# Altium schematic sheet DAC.SchDoc: Digital to Analog Converter
size A4; SheetNumber: 2; SheetTotal: 4
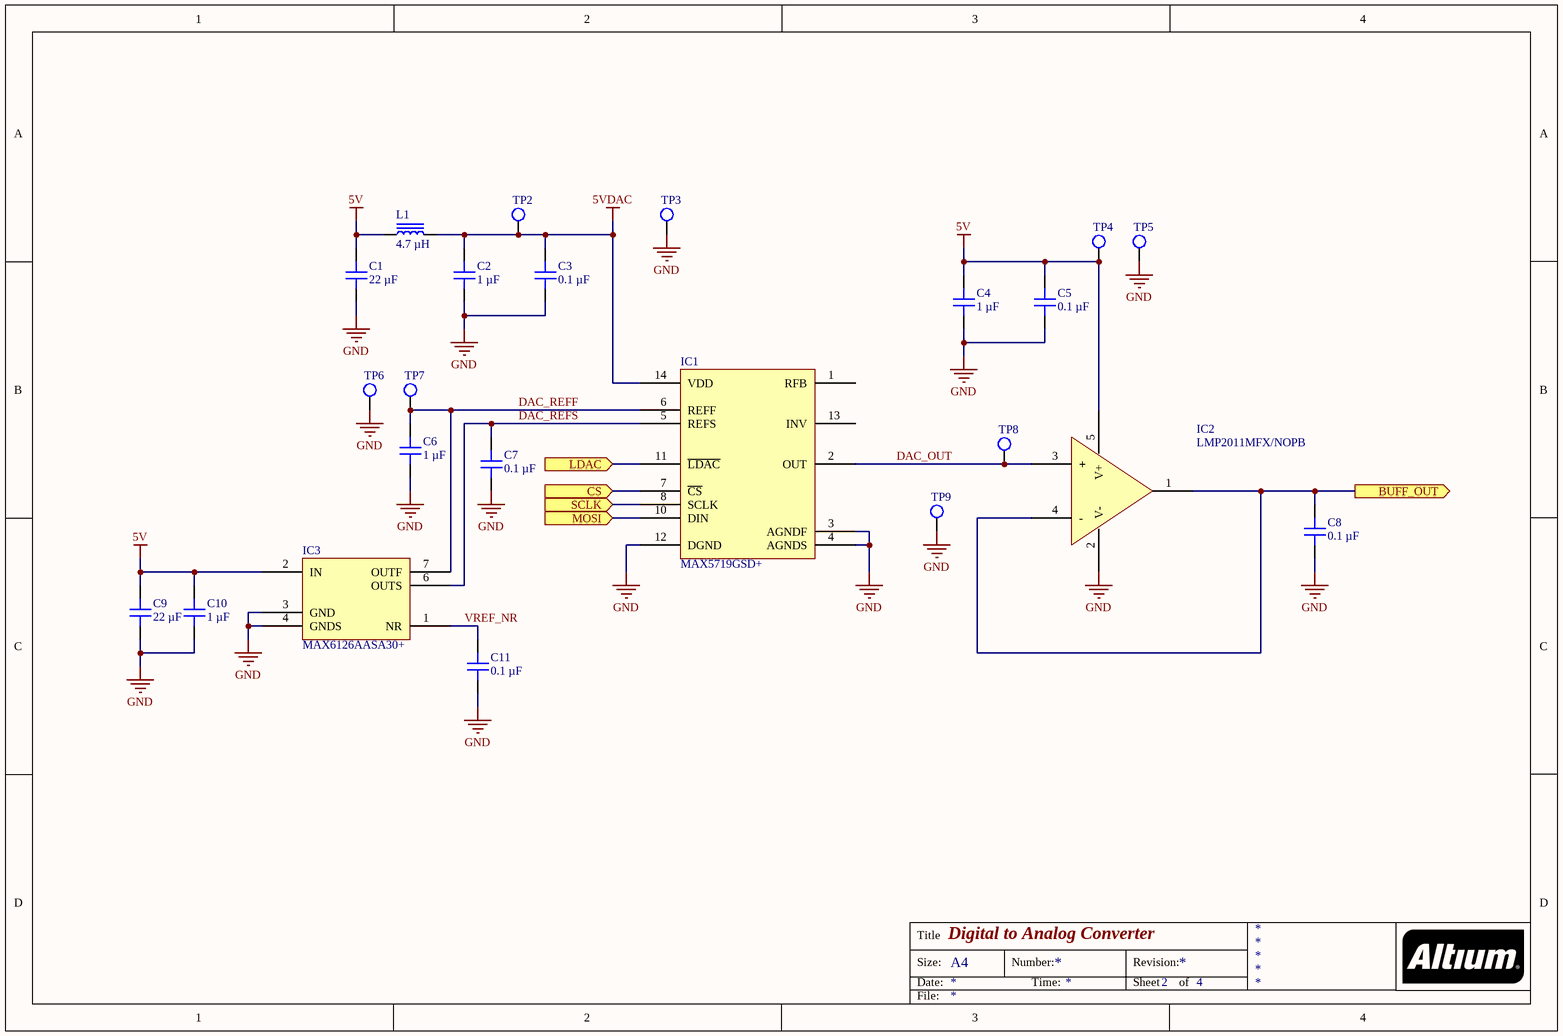
[diagram p0: DAC.SchDoc]

## Parts
C1  22 µF  [CAP 0603_1608]
C2  1 µF  [CAP 0603_1608]
C3  0.1 µF  [CAP 0603_1608]
C4  1 µF  [CAP 0603_1608]
C5  0.1 µF  [CAP 0603_1608]
C6  1 µF  [CAP 0603_1608]
C7  0.1 µF  [CAP 0603_1608]
C8  0.1 µF  [CAP 0603_1608]
C9  22 µF  [CAP 0603_1608]
C10  1 µF  [CAP 0603_1608]
C11  0.1 µF  [CAP 0603_1608]
IC1  MAX5719GSD+  [AD SOIC-14 S14+4]
IC2  LMP2011MFX/NOPB  [TI SOT-23-5 DBV]
IC3  MAX6126AASA30+  [AD SOIC-8 S8+4]
L1  4.7 µH  [WURTH WE-LQS 3015]
TP2  Test Point  [TestPoint-1.5mm]  (value not drawn)  (no BOM)
TP3  Test Point  [TestPoint-1.5mm]  (value not drawn)  (no BOM)
TP4  Test Point  [TestPoint-1.5mm]  (value not drawn)  (no BOM)
TP5  Test Point  [TestPoint-1.5mm]  (value not drawn)  (no BOM)
TP6  Test Point  [TestPoint-1.5mm]  (value not drawn)  (no BOM)
TP7  Test Point  [TestPoint-1.5mm]  (value not drawn)  (no BOM)
TP8  Test Point  [TestPoint-1.5mm]  (value not drawn)  (no BOM)
TP9  Test Point  [TestPoint-1.5mm]  (value not drawn)  (no BOM)

## Ports
BUFF_OUT (out), CS (in), LDAC (in), MOSI (in), SCLK (in)

## Nets
5V: C1.2 C4.2 C5.1 C9.2 C10.2 IC2.5(V+) IC3.2(IN) L1.1 TP4.1(TP)
5VDAC: C2.2 C3.1 IC1.14(VDD) L1.2 TP2.1(TP)
GND: C1.1 C2.1 C3.2 C4.1 C5.2 C6.1 C7.2 C8.2 C9.1 C10.1 C11.2 IC1.3(AGNDF) IC1.4(AGNDS) IC1.12(DGND) IC2.2(V-) IC3.3(GND) IC3.4(GNDS) TP3.1(TP) TP5.1(TP) TP6.1(TP) TP9.1(TP)
BUFF_OUT: C8.1 IC2.1(OUT) IC2.4(-) ; port BUFF_OUT
CS: IC1.7(~{CS}) ; port CS
DAC_OUT: IC1.2(OUT) IC2.3(+) TP8.1(TP)
DAC_REFF: C6.2 IC1.6(REFF) IC3.7(OUTF) TP7.1(TP)
DAC_REFS: C7.1 IC1.5(REFS) IC3.6(OUTS)
LDAC: IC1.11(~{LDAC}) ; port LDAC
MOSI: IC1.10(DIN) ; port MOSI
SCLK: IC1.8(SCLK) ; port SCLK
VREF_NR: C11.1 IC3.1(NR)

Not connected (* = marked no-connect by the designer): IC1 1(RFB) 13(INV)

## Notes on the sheet
- Title
- Size:
- Date:
- A4
- Number:
- Time:
- Revision:
- Sheet
- of
- File:

## Library data of the parts
C1 C9 = CL10A226MP8NUNE: CAP CER 22UF 10V X5R 0603; manufacturer: Samsung Electro-Mechanics; Tolerance: ±20%; Part Number: CL10A226MP8NUNE; Value: 22 µF; Applications: General Purpose; Capacitance: 22 µF; componentlink1description: Datasheet; componentlink1url: http://www.samsungsem.com/kr/support/product-search/mlcc/CL10A226MP8NUNE.jsp; componentlink2description: DigiKey Link; componentlink2url: https://www.digikey.com/en/products/detail/samsung-electro-mechanics/CL10A226MP8NUNE/3886932; Device Package: 0603 (1608 Metric); lastupdated: 02/11/2023 19:13:02; Lifecycle Status: Active; Minimum Order: 1; Mounting Type: Surface Mount, MLCC; Operating Temperature: -55°C ~ 85°C; Package / Case: 0603 (1608 Metric); packaging: TapeAndReel; partid: 11458; Part Status: Active; price: 0.02; series: CL; Size / Dimension: 0.063" L x 0.031" W (1.60mm x 0.80mm); Supplier 1: DigiKey; Supplier Part Number 1: 1276-1274-1-ND; Temperature Coefficient: X5R; Thickness (Max): 0.035" (0.90mm); Voltage - Rated: 10V
C2 C4 C6 C10 = GCM188R71E105KA64D: CAP CER 1UF 25V X7R 0603; manufacturer: Murata Electronics; Tolerance: ±10%; Part Number: GCM188R71E105KA64D; Value: 1 µF; Applications: Automotive; Capacitance: 1 µF; componentlink1description: Datasheet; componentlink1url: https://www.murata.com/~/media/webrenewal/support/library/catalog/products/capacitor/mlcc/c03e.ashx?la=en-us; componentlink2description: DigiKey Link; componentlink2url: https://www.digikey.com/en/products/detail/murata-electronics/GCM188R71E105KA64D/4903956; Device Package: 0603 (1608 Metric); lastupdated: 20/08/2023 19:09:04; Lifecycle Status: Active; Minimum Order: 1; Mounting Type: Surface Mount, MLCC; Operating Temperature: -55°C ~ 125°C; Package / Case: 0603 (1608 Metric); packaging: TapeAndReel; partid: 6762; Part Status: Active; price: 0.03; Ratings: AEC-Q200; series: GCM; Size / Dimension: 0.063" L x 0.031" W (1.60mm x 0.80mm); Supplier 1: DigiKey; Supplier Part Number 1: 490-10673-1-ND; Temperature Coefficient: X7R; Thickness (Max): 0.035" (0.90mm); Voltage - Rated: 25V
C3 C5 C7 C8 C11 = CL10B104KB8NNNC: CAP CER 0.1UF 50V X7R 0603; manufacturer: Samsung Electro-Mechanics; Tolerance: ±10%; Part Number: CL10B104KB8NNNC; Value: 0.1 µF; Applications: General Purpose; Capacitance: 0.1 µF; componentlink1description: Datasheet; componentlink1url: http://www.samsungsem.com/kr/support/product-search/mlcc/CL10B104KB8NNNC.jsp; componentlink2description: DigiKey Link; componentlink2url: https://www.digikey.com/en/products/detail/samsung-electro-mechanics/CL10B104KB8NNNC/3886658; Device Package: 0603 (1608 Metric); lastupdated: 02/11/2023 19:13:06; Lifecycle Status: Active; Minimum Order: 1; Mounting Type: Surface Mount, MLCC; Operating Temperature: -55°C ~ 125°C; Package / Case: 0603 (1608 Metric); packaging: TapeAndReel; partid: 9788; Part Status: Active; price: 0.01; series: CL; Size / Dimension: 0.063" L x 0.031" W (1.60mm x 0.80mm); Supplier 1: DigiKey; Supplier Part Number 1: 1276-1000-1-ND; Temperature Coefficient: X7R; Thickness (Max): 0.035" (0.90mm); Voltage - Rated: 50V
IC1 = MAX5719GSD+: IC DAC 20BIT V-OUT 14SOIC; Manufacturer: Analog Devices Inc./Maxim Integrated; Architecture: R-2R; Data Interface: SPI, DSP; Differential Output: No; INL/DNL (LSB): ±1, ±1; Number of Bits: 20; Number of D/A Converters: 1; Output Type: Voltage - Unbuffered; Reference Type: External; Settling Time: 1.5µs (Typ); Voltage - Supply, Analog: 5V; Part Number: MAX5719GSD+; ComponentLink1Description: Datasheet; ComponentLink1URL: https://datasheets.maximintegrated.com/en/ds/MAX5717-MAX5719.pdf; ComponentLink2Description: DigiKey Link; ComponentLink2URL: https://www.digikey.com/en/products/detail/analog-devices-inc-maxim-integrated/MAX5719GSD/6166219; LastUpdated: 16/03/2024 19:39:58; Lifecycle Status: Active; Minimum Order: 1; Mounting Type: Surface Mount; Operating Temperature: -40°C ~ 105°C; Packaging: Tube; PartId: 4; Part Status: Active; Price: 24.08; Series: -; Supplier 1: DigiKey; Supplier Part Number 1: MAX5719GSD+-ND; Supplier Device Package: 14-SOIC; Voltage - Supply, Digital: 5V
IC2 = LMP2011MFX/NOPB: IC OPAMP GP 1 CIRCUIT SOT23-5; Manufacturer: Texas Instruments; Amplifier Type: General Purpose; Current - Input Bias: 3 pA; Current - Output / Channel: 17 mA; Current - Supply: 930µA; Gain Bandwidth Product: 3 MHz; Number of Circuits: 1; Output Type: Rail-to-Rail; Slew Rate: 4V/µs; Voltage - Input Offset: 0.12 µV; Voltage - Supply, Single/Dual (±): 2.7V ~ 5.25V; Part Number: LMP2011MFX/NOPB; ComponentLink1Description: Datasheet; ComponentLink1URL: http://www.ti.com/general/docs/suppproductinfo.tsp?distId=10&gotoUrl=http%3A%2F%2Fwww.ti.com%2Flit%2Fgpn%2Flmp2011; ComponentLink2Description: DigiKey Link; ComponentLink2URL: https://www.digikey.com/en/products/detail/texas-instruments/LMP2011MFX-NOPB/1872224; LastUpdated: 22/03/2024 21:05:57; Lifecycle Status: Active; Minimum Order: 1; Mounting Type: Surface Mount; Operating Temperature: -40°C ~ 125°C; Package / Case: SC-74A, SOT-753; Packaging: TapeAndReel; PartId: 61; Part Status: Active; Price: 1.14; Series: LMP®; Supplier 1: DigiKey; Supplier Part Number 1: LMP2011MFX/NOPBCT-ND; Supplier Device Package: SOT-23-5
IC3 = MAX6126AASA30+: IC VREF SERIES 0.02% 8SOIC; Manufacturer: Maxim Integrated; Current - Output: 10mA; Current - Supply: 725µA; Noise - 0.1Hz to 10Hz: 1.75µVp-p; Output Type: Fixed; Temperature Coefficient: 5ppm/°C; Voltage - Input: 3.2V ~ 12.6V; Voltage - Output (Min/Fixed): 3V; Part Number: MAX6126AASA30+; ComponentLink1Description: Datasheet; ComponentLink1URL: https://datasheets.maximintegrated.com/en/ds/MAX6126.pdf; ComponentLink2Description: DigiKey Link; ComponentLink2URL: http://digikey.com/product-detail/en/maxim-integrated/MAX6126AASA30/MAX6126AASA30-ND/1867184; LastUpdated: 16/03/2024 19:47:53; Lifecycle Status: Active; Minimum Order: 1; Mounting Type: Surface Mount; Operating Temperature: -40°C ~ 125°C (TA); Package / Case: 8-SOIC (0.154", 3.90mm Width); Packaging: Tube; Part Status: Active; Price: 7.82; Reference Type: Series; Series: -; Supplier 1: DigiKey; Supplier Part Number 1: MAX6126AASA30+-ND; Supplier Device Package: 8-SOIC; Tolerance: ±0.02%
L1 = 74404032047: FIXED IND 4.7UH 1.3A 96 MOHM SMD; Manufacturer: Würth Elektronik; Current - Saturation: 1.2A; DC Resistance (DCR): 96mOhm; Frequency - Self Resonant: 50MHz; Inductance Frequency - Test: 100 kHz; Material - Core: Ferrite; Shielding: Shielded; Tolerance: ±20%; Type: Drum Core, Wirewound; Part Number: 74404032047; ComponentLink1Description: Datasheet; ComponentLink1URL: https://katalog.we-online.de/pbs/datasheet/74404032047.pdf; ComponentLink2Description: DigiKey Link; ComponentLink2URL: https://www.digikey.com/en/products/detail/würth-elektronik/74404032047/4865640; Current Rating (Amps): 1.3 A; Device Package: Nonstandard; Height - Seated (Max): 0.059" (1.50mm); Inductance: 4.7 µH; LastUpdated: 16/03/2024 20:32:51; Lifecycle Status: Active; Minimum Order: 1; Mounting Type: Surface Mount; Operating Temperature: -40°C ~ 125°C; Package / Case: Nonstandard; Packaging: TapeAndReel; PartId: 7005; Part Status: Active; Price: 0.66; Ratings: AEC-Q200; Series: WE-LQS; Size / Dimension: 0.118" L x 0.118" W (3.00mm x 3.00mm); Supplier 1: DigiKey; Supplier Part Number 1: 732-5495-1-ND; Supplier Device Package: 3015; Value: 4.7 µH
TP2-TP9 = CMP-003-000000-1: Component Type: Standard (No BOM); Source: Test Point.SchLib; Design Item ID: Test Point; Pin Count: 1